# Altium schematic sheet CT.SchDoc: Conning Tower
size Tabloid; DocumentNumber: FB-001; Revision: A; SheetNumber: 2; SheetTotal: 5
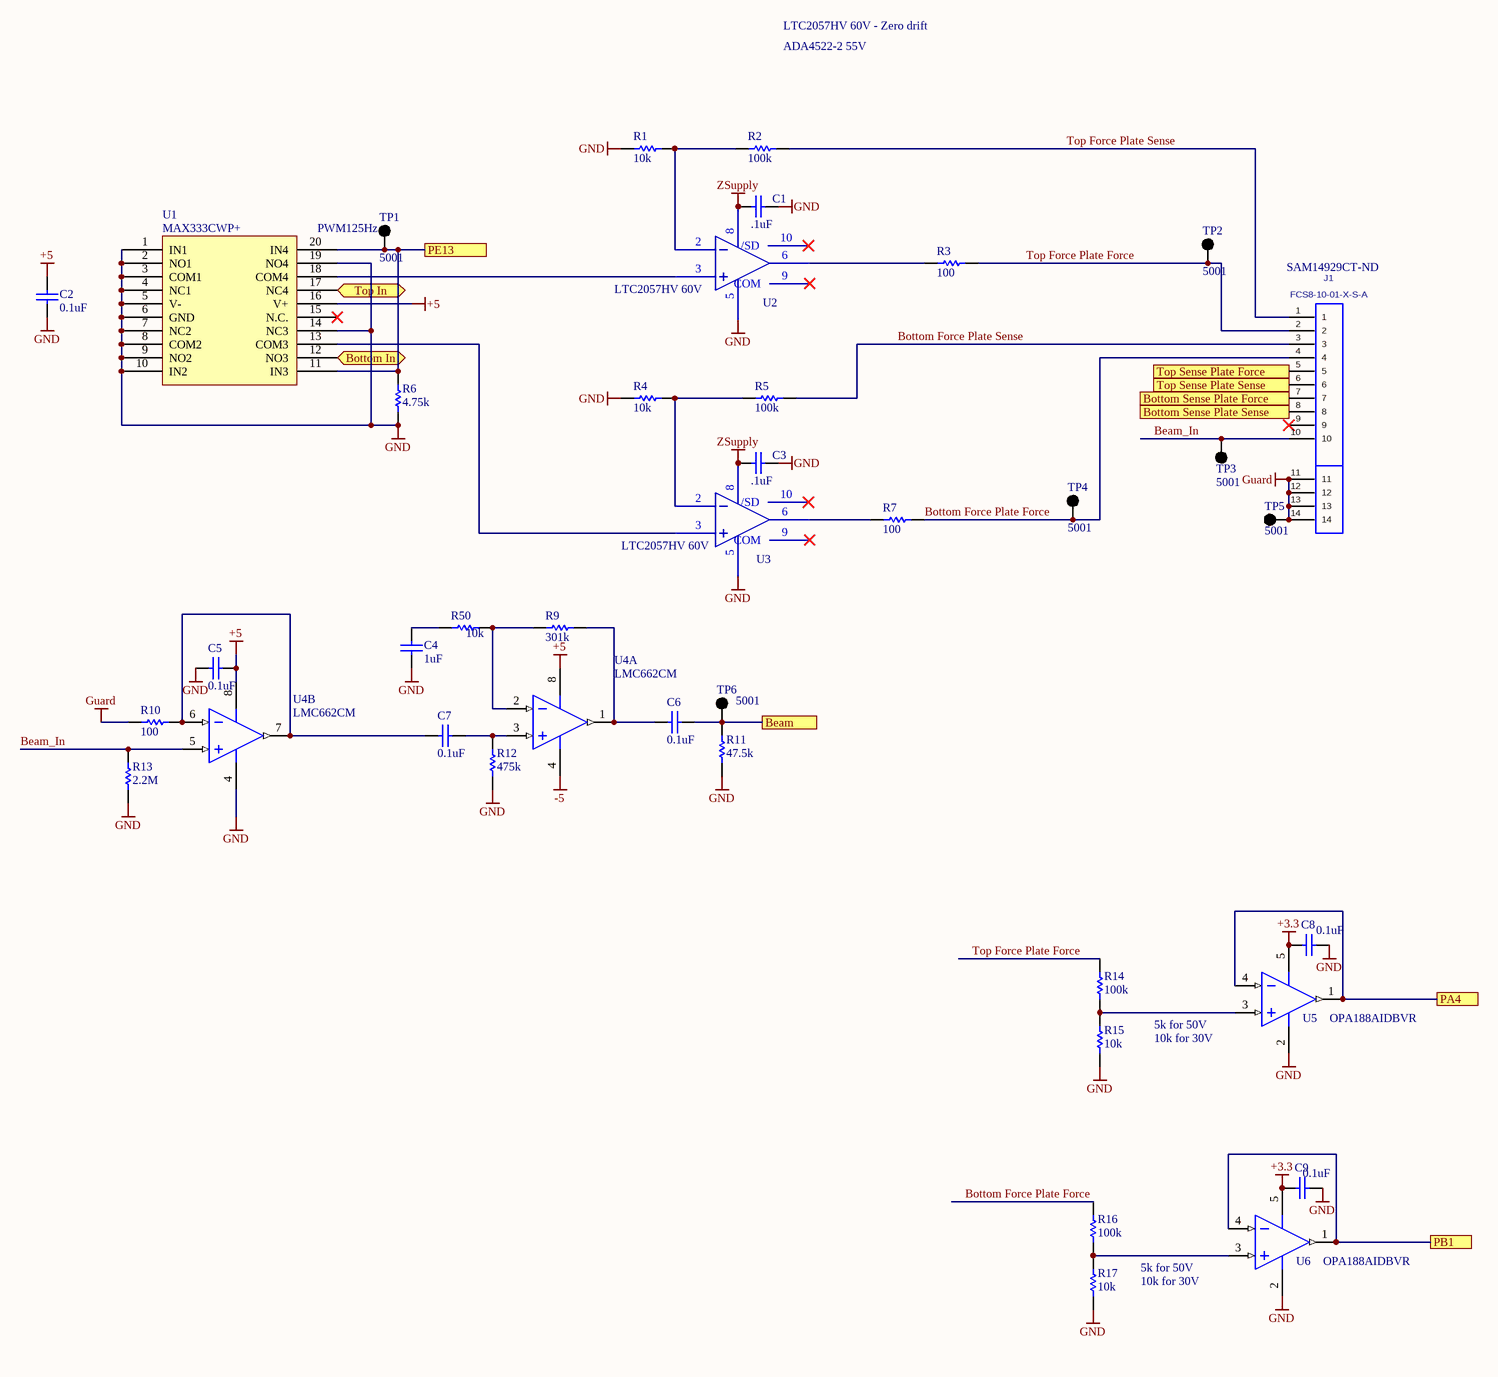
[diagram p0: CT.SchDoc]

## Parts
C1  .1uF  [CAPC0805(2012)75_M]
C2  0.1uF  [CAPC0402(1005)60_L]
C3  .1uF  [CAPC0805(2012)75_M]
C4  1uF  [CAPC0402(1005)60_L]
C5  0.1uF  [CAPC0402(1005)60_L]
C6  0.1uF  [CAPC0402(1005)60_L]
C7  0.1uF  [CAPC0402(1005)60_L]
C8  0.1uF  [CAPC0402(1005)60_L]
C9  0.1uF  [CAPC0402(1005)60_L]
J1  FCS8-10-01-X-S-A  Supplier Part Number 1: SAM14929CT-ND  [FCS8-10-01-X-S-A]
R1  10k  [RESC0402(1005)_M]
R2  100k  [RESC0402(1005)_M]
R3  100  [RESC0402(1005)_N]
R4  10k  [RESC0402(1005)_M]
R5  100k  [RESC0402(1005)_M]
R6  4.75k  [RESC1005X40X25ML05T05]
R7  100  [RESC0402(1005)_N]
R9  301k  [RESC0402(1005)_M]
R10  100  [RESC0402(1005)_M]
R11  47.5k  [RESC1005X40X25NL05T05]
R12  475k  [RESC1005X40X25LL05T05]
R13  2.2M  [RESC1005X40X25ML05T10]
R14  100k  [RESC0402(1005)_M]
R15  10k  [RESC0402(1005)_M]
R16  100k  [RESC0402(1005)_M]
R17  10k  [RESC0402(1005)_M]
R50  10k  [RESC0402(1005)_M]
TP1  5001  [KSTN-5001]
TP2  5001  [KSTN-5001]
TP3  5001  [KSTN-5001]
TP4  5001  [KSTN-5001]
TP5  5001  [KSTN-5001]
TP6  5001  [KSTN-5001]
U1  MAX333CWP+  [TSOP65P640X90-20N]
U2  LTC2057HV 60V
U3  LTC2057HV 60V
U4  LMC662CM  [D0008A_M]  (parts A,B of 2)
U5  OPA188AIDBVR  [DBV0005A_M]
U6  OPA188AIDBVR  [DBV0005A_M]

## Ports
Beam, Bottom In (bidir), Bottom Sense Plate Force, Bottom Sense Plate Sense, PA4, PB1, PE13, Top In (bidir), Top Sense Plate Force, Top Sense Plate Sense

## Nets
+3.3: C8.2 C9.2 U5.5(V+) U6.5(V+)
+5: C2.2 C5.2 U1.16(V+) U4.8(V+)
-5: U4.4(V-)
GND: C1.2 C2.1 C3.2 C4.1 C5.1 C8.1 C9.1 R1.1 R4.1 R6.1 R11.1 R12.1 R13.1 R15.1 R17.1 U1.1(IN1) U1.2(NO1) U1.3(COM1) U1.4(NC1) U1.5(V-) U1.6(GND) U1.7(NC2) U1.8(COM2) U1.9(NO2) U1.10(IN2) U1.14(NC3) U1.19(NO4) U2.5(V-) U3.5(V-) U4.4(V-) U5.2(V-) U6.2(V-)
Guard: J1.11 J1.12 J1.13 J1.14 R10.1 TP5.1
ZSupply: C1.1 C3.1 U2.8(V+) U3.8(V+)
Beam: C6.2 R11.2 TP6.1 ; port Beam
Beam_In: J1.10 R13.2 TP3.1 U4.5(INB+)
Bottom Force Plate Force: J1.4 R7.2 R16.2 TP4.1
Bottom Force Plate Sense: J1.3 R5.2
Bottom In: U1.12(NO3) ; port Bottom In
Bottom Sense Plate Force: J1.7 ; port Bottom Sense Plate Force
Bottom Sense Plate Sense: J1.8 ; port Bottom Sense Plate Sense
PA4: U5.1(OUT) U5.4(IN-) ; port PA4
PB1: U6.1(OUT) U6.4(IN-) ; port PB1
PE13: R6.2 TP1.1 U1.11(IN3) U1.20(IN4) ; port PE13
Top Force Plate Force: J1.2 R3.2 R14.2 TP2.1
Top Force Plate Sense: J1.1 R2.2
Top In: U1.17(NC4) ; port Top In
Top Sense Plate Force: J1.5 ; port Top Sense Plate Force
Top Sense Plate Sense: J1.6 ; port Top Sense Plate Sense
NetC4_2: C4.2 R50.1
NetC6_1: C6.1 R9.1 U4.1(OUTA)
NetC7_1: C7.1 R10.2 U4.6(INB-) U4.7(OUTB)
NetC7_2: C7.2 R12.2 U4.3(INA+)
NetR1_2: R1.2 R2.1 U2.2(-IN)
NetR3_1: R3.1 U2.6(OUT)
NetR4_2: R4.2 R5.1 U3.2(-IN)
NetR7_1: R7.1 U3.6(OUT)
NetR9_2: R9.2 R50.2 U4.2(INA-)
NetR14_1: R14.1 R15.2 U5.3(IN+)
NetR16_1: R16.1 R17.2 U6.3(IN+)
NetU1_13: U1.13(COM3) U3.3(+IN)
NetU1_18: U1.18(COM4) U2.3(+IN)

Not connected (* = marked no-connect by the designer): J1 9*; U1 15(N.C.)*; U2 7(N.C.) 9(COM)* 10(/SD)*; U3 7(N.C.) 9(COM)* 10(/SD)*

## Notes on the sheet
- LTC2057HV 60V - Zero drift
- ADA4522-2 55V
- PWM125Hz
- 5k for 50V
- 10k for 30V
- Title
- Size:
- Date:
- Tabloid
- Number:
- Time:
- Revision:
- Sheet
- of
- ZLS Corporation
- 7801 North Lamar Blvd.
- Suite E-184
- Austin, Texas 78752  USA
- (512) 453-0288
- File:

## Library data of the parts
C1 C3 = CMP-1036-01414-1: 0.1µF ±10% 16V Ceramic Capacitor X7R 0805 (2012 Metric); Manufacturer: Yageo; Manufacturer Part Number: CC0805KRX7R7BB104; Capacitance: 100nF; Insulation Resistance: 100GR; Supplier 1: Future Electronics; Supplier Part Number 1: CC0805KRX7R7BB104-CUTT; Stock 1: 160; Pricing 1: 1=0.0364, 100=0.0181, 250=0.0158, 500=0.0142, 1500=0.012 (USD); Mount: Surface Mount; Case/Package: 0805; Number of Pins: 2; Case Code (Metric): 2012; Case Code (Imperial): 0805; Min Operating Temperature: -55°C; Max Operating Temperature: 125°C; Tolerance: 10%; Dielectric: X7R; Voltage Rating: 16V; Voltage Rating (DC): 16V; Packaging: Tape and Reel; Package Quantity: 1; Termination: SMD/SMT; Composition: Ceramic; Voltage: 16V; Length: 2mm; Height: 0.85mm; Depth: 1.25mm; Width: 0.049inch; Thickness: 0.033inch; Radiation Hardening: No; REACH SVHC: No SVHC; Lead Free: Lead Free; Halogen Free: Halogen Free; ComponentLink1URL: http://www.farnell.com/datasheets/1784427.pdf?src-supplier=Element14; ComponentLink1Description: http://www.farnell.com/datasheets/1784427.pdf?src-supplier=Element14; ComponentLink2URL: https://www.verical.com/server-webapp/html/getDatasheet?partID=314877&src-supplier=Verical; ComponentLink2Description: https://www.verical.com/server-webapp/html/getDatasheet?partID=314877&src-supplier=Verical; ComponentLink3URL: http://www.yageo.com/documents/recent/UPY-GPHC_X7R_6.3V-to-50V_18.pdf?src-supplier=Digi-Key; ComponentLink3Description: http://www.yageo.com/documents/recent/UPY-GPHC_X7R_6.3V-to-50V_18.pdf?src-supplier=Digi-Key; ComponentLink4URL: http://www.yageo.com/documents/recent/UPY-GPHC_X7R_6.3V-to-50V_8.pdf?src-supplier=Avnet; ComponentLink4Description: http://www.yageo.com/documents/recent/UPY-GPHC_X7R_6.3V-to-50V_8.pdf?src-supplier=Avnet; ComponentLink5URL: http://www.yageo.com/documents/recent/UPY-GPHC_X7R_6.3V-to-50V_8.pdf?src-supplier=Avnet+Europe; ComponentLink5Description: http://www.yageo.com/documents/recent/UPY-GPHC_X7R_6.3V-to-50V_8.pdf?src-supplier=Avnet+Europe; ComponentLink6URL: http://www.farnell.com/datasheets/1489800.pdf?src-supplier=Element14; ComponentLink6Description: http://www.farnell.com/datasheets/1489800.pdf?src-supplier=Element14
C2 C5-C9 = CMP-1034-00252-1: CAP CER 0.1UF 10V X7R 0402; Manufacturer: Murata Electronics North America; Manufacturer Part Number: GRM155R71A104KA01D; Tolerance: ±10%; Supplier 1: Digi-Key; Supplier Part Number 1: 490-6321-1-ND; RoHS: RoHS Compliant; Category: Capacitors; Stock 1: 2920395; Pricing 1: 1=0.1, 10=0.014, 100=0.0063, 500=0.00446, 1000=0.00351, 2500=0.00319, 5000=0.00293 (USD); Packaging: Cut Tape (CT); Part Status: Active; Voltage - Rated: 10V; Temperature Coefficient: X7R; Operating Temperature: -55°C ~ 125°C; Features: -; Ratings: -; Applications: General Purpose; Mounting Type: Surface Mount, MLCC; Package / Case: 0402 (1005 Metric); Size / Dimension: 0.039" L x 0.020" W (1.00mm x 0.50mm); Height - Seated (Max): -; Thickness (Max): 0.022" (0.55mm); Lead Spacing: -; ComponentLink1URL: http://www.murata.com/~/media/webrenewal/support/library/catalog/products/capacitor/mlcc/c02e.ashx?la=en-us; ComponentLink1Description: http://www.murata.com/~/media/webrenewal/support/library/catalog/products/capacitor/mlcc/c02e.ashx?la=en-us
C4 = CMP-1034-00252-1: 1µF ±10% 16V Ceramic Capacitor X5R 0402 (1005 Metric); Manufacturer: Samsung; Manufacturer Part Number: CL05A105KO5NNNC; Supplier 1: Future Electronics; Supplier Part Number 1: CL05A105KO5NNNC-CUTT; Stock 1: 8167; Pricing 1: 1=0.0074, 500=0.0064, 1500=0.0062, 2500=0.0061, 5000=0.006 (USD); Mount: Surface Mount; Case/Package: 0402; Case Code (Metric): 1005; Case Code (Imperial): 0402; Contact Plating: Tin; Min Operating Temperature: -55°C; Max Operating Temperature: 85°C; Tolerance: 10%; Capacitance: 1uF; Dielectric: X5R; Packaging: Tape and Reel; Package Quantity: 1; Voltage Rating: 16V; Voltage: 16V; Length: 1mm; Height: 0.5mm; Width: 0.02inch; Thickness: 0.022inch; Depth: 0.5mm; Radiation Hardening: No; ComponentLink1URL: http://www1.futureelectronics.com/doc/SAMSUNG/CL05A105KO5NNNC.pdf?src-supplier=Future+Electronics; ComponentLink1Description: http://www1.futureelectronics.com/doc/SAMSUNG/CL05A105KO5NNNC.pdf?src-supplier=Future+Electronics; ComponentLink2URL: https://www.verical.com/server-webapp/html/getDatasheet?partID=355272&src-supplier=Verical; ComponentLink2Description: https://www.verical.com/server-webapp/html/getDatasheet?partID=355272&src-supplier=Verical
J1 = FCS8-10-01-X-S-A: FCS8 Socket Assembly, 20-Pins, w/ Alignment Pins; Manufacturer: Samtec; Manufacturer Part Number: FCS8-10-01-L-S-A-TR; Connector Type: Receptacle; Number of Positions: 10; CREATED: 31 NOV 2013 - WENDY XIN; Supplier 1: Digi-Key; Stock 1: 500; Pricing 1: 1=4.29000, 10=4.11800, 25=3.77520, 50=3.60360, 100=3.43200 (USD); RoHS: Yes; Mount: Surface Mount; Contact Plating: Gold; Features: Shielded; Packaging: Tape and Reel; Termination: Solder; ComponentLink1URL: http://cloud.samtec.com/catalog_english/fcs8.pdf?src-supplier=Avnet; ComponentLink1Description: http://cloud.samtec.com/catalog_english/fcs8.pdf?src-supplier=Avnet
R1 R4 R15 R17 R50 = CMP-1011-00940-1: 10k 0.063W 1% 0402 (1005 Metric)  SMD; Manufacturer: Panasonic; Manufacturer Part Number: ERJ-2RKF1002X; Resistance: 10kR; Temperature Coefficient: 100ppm/°C; Power Rating: 100mW; Voltage Rating: 50V; Supplier 1: Digi-Key; Supplier Part Number 1: P10.0KLDKR-ND; Stock 1: 12501303; Pricing 1: 1=0.10000, 10=0.04500, 100=0.01830, 1000=0.00823, 2500=0.00715, 5000=0.00590 (USD); RoHS: Yes; Mount: Surface Mount; Case/Package: 0402; Number of Pins: 2; Case Code (Metric): 1005; Case Code (Imperial): 0402; Contact Plating: Tin; Min Operating Temperature: -55°C; Max Operating Temperature: 155°C; Tolerance: 1%; Packaging: Tape and Reel; Composition: Thick Film; Termination: SMD/SMT; Voltage Rating (DC): 50V; Package Quantity: 1; Number of Terminations: 2; Max Power Dissipation: 100mW; Military Standard: Not; Features: Automotive AEC-Q200; Length: 1mm; Height: 0.35mm; Width: 0.02inch; Depth: 0.5mm; Radiation Hardening: No; Lead Free: Lead Free; REACH SVHC: No SVHC; ComponentLink1URL: https://datasheet.ciiva.com/11821/0900766b80f80784-11821171.pdf?src-supplier=RSComponents; ComponentLink1Description: https://datasheet.ciiva.com/11821/0900766b80f80784-11821171.pdf?src-supplier=RSComponents; ComponentLink2URL: https://datasheet.ciiva.com/16199/aoa0000ce2-16199478.pdf?src-supplier=Future+Electronics; ComponentLink2Description: https://datasheet.ciiva.com/16199/aoa0000ce2-16199478.pdf?src-supplier=Future+Electronics; ComponentLink3URL: https://datasheet.ciiva.com/17212/aoa0000ce2-17212102.pdf?src-supplier=Avnet+Europe; ComponentLink3Description: https://datasheet.ciiva.com/17212/aoa0000ce2-17212102.pdf?src-supplier=Avnet+Europe; ComponentLink4URL: https://datasheet.ciiva.com/24023/aoa0000ce2-24023017.pdf?src-supplier=Mouser; ComponentLink4Description: https://datasheet.ciiva.com/24023/aoa0000ce2-24023017.pdf?src-supplier=Mouser; ComponentLink5URL: https://datasheet.ciiva.com/28514/1678782-28514185.pdf?src-supplier=Element14; ComponentLink5Description: https://datasheet.ciiva.com/28514/1678782-28514185.pdf?src-supplier=Element14; ComponentLink6URL: https://datasheet.ciiva.com/43467/1678782-43467402.pdf?src-supplier=Farnell; ComponentLink6Description: https://datasheet.ciiva.com/43467/1678782-43467402.pdf?src-supplier=Farnell; ComponentLink7URL: https://datasheet.ciiva.com/27055/1987020-27055643.pdf?src-supplier=Jameco; ComponentLink7Description: https://datasheet.ciiva.com/27055/1987020-27055643.pdf?src-supplier=Jameco; ComponentLink8URL: https://datasheet.ciiva.com/48531/aoa0000ce2-48531069.pdf?src-supplier=Avnet; ComponentLink8Description: https://datasheet.ciiva.com/48531/aoa0000ce2-48531069.pdf?src-supplier=Avnet; ComponentLink9URL: https://datasheet.ciiva.com/9194/aoa0000ce2-9194142.pdf?src-supplier=Avnet; ComponentLink9Description: https://datasheet.ciiva.com/9194/aoa0000ce2-9194142.pdf?src-supplier=Avnet; ComponentLink10URL: https://datasheet.ciiva.com/16782/70260748-16782590.pdf?src-supplier=Allied+Electronics; ComponentLink10Description: https://datasheet.ciiva.com/16782/70260748-16782590.pdf?src-supplier=Allied+Electronics; ComponentLink11URL: https://datasheet.ciiva.com/16786/70260748-16786734.pdf?src-supplier=Allied+Electronics; ComponentLink11Description: https://datasheet.ciiva.com/16786/70260748-16786734.pdf?src-supplier=Allied+Electronics; ComponentLink12URL: https://datasheet.ciiva.com/30201/aoa0000ce2-30201022.pdf?src-supplier=Onlinecomponents.com; ComponentLink12Description: https://datasheet.ciiva.com/30201/aoa0000ce2-30201022.pdf?src-supplier=Onlinecomponents.com
R2 R5 R14 R16 = CMP-1011-00940-1: 100k 0.063W 1% 0402 (1005 Metric)  SMD; Manufacturer: Panasonic; Manufacturer Part Number: ERJ-2RKF1003X; Resistance: 100kR; Power Rating: 100mW; Temperature Coefficient: 100ppm/°C; Voltage Rating: 50V; Supplier 1: Digi-Key; Supplier Part Number 1: P100KLCT-ND; Stock 1: 9533476; Pricing 1: 1=0.10000, 10=0.04500, 100=0.01830, 1000=0.00823, 2500=0.00715, 5000=0.00590 (USD); RoHS: Yes; Mount: Surface Mount; Case/Package: 0402; Number of Pins: 2; Case Code (Imperial): 0402; Case Code (Metric): 1005; Contact Plating: Tin; Min Operating Temperature: -55°C; Max Operating Temperature: 155°C; Tolerance: 1%; Packaging: Tape and Reel; Composition: Thick Film; Voltage Rating (DC): 50V; Termination: SMD/SMT; Military Standard: Not; Package Quantity: 1; Number of Terminations: 2; Max Power Dissipation: 100mW; Features: Automotive AEC-Q200; Length: 1mm; Height: 0.35mm; Width: 0.5mm; Depth: 0.5mm; Radiation Hardening: No; Lead Free: Lead Free; REACH SVHC: No SVHC; ComponentLink1URL: https://datasheet.ciiva.com/11821/0900766b80f80784-11821175.pdf?src-supplier=RSComponents; ComponentLink1Description: https://datasheet.ciiva.com/11821/0900766b80f80784-11821175.pdf?src-supplier=RSComponents; ComponentLink2URL: https://datasheet.ciiva.com/34303/1987038-34303550.pdf?src-supplier=Jameco; ComponentLink2Description: https://datasheet.ciiva.com/34303/1987038-34303550.pdf?src-supplier=Jameco; ComponentLink3URL: https://datasheet.ciiva.com/7830/aoa0000ce2-7830725.pdf?src-supplier=Element14; ComponentLink3Description: https://datasheet.ciiva.com/7830/aoa0000ce2-7830725.pdf?src-supplier=Element14; ComponentLink4URL: https://datasheet.ciiva.com/16522/aoa0000ce2-16522647.pdf?src-supplier=Avnet+Asia; ComponentLink4Description: https://datasheet.ciiva.com/16522/aoa0000ce2-16522647.pdf?src-supplier=Avnet+Asia; ComponentLink5URL: https://datasheet.ciiva.com/16778/70260748-16778055.pdf?src-supplier=Allied+Electronics; ComponentLink5Description: https://datasheet.ciiva.com/16778/70260748-16778055.pdf?src-supplier=Allied+Electronics; ComponentLink6URL: https://datasheet.ciiva.com/43467/1678782-43467480.pdf?src-supplier=Farnell; ComponentLink6Description: https://datasheet.ciiva.com/43467/1678782-43467480.pdf?src-supplier=Farnell; ComponentLink7URL: https://datasheet.ciiva.com/16440/aoa0000ce2-16440217.pdf?src-supplier=Future+Electronics; ComponentLink7Description: https://datasheet.ciiva.com/16440/aoa0000ce2-16440217.pdf?src-supplier=Future+Electronics; ComponentLink8URL: https://datasheet.ciiva.com/30245/aoa0000ce2-30245691.pdf?src-supplier=Onlinecomponents.com; ComponentLink8Description: https://datasheet.ciiva.com/30245/aoa0000ce2-30245691.pdf?src-supplier=Onlinecomponents.com; ComponentLink9URL: https://datasheet.ciiva.com/7830/426256-7830974.pdf?src-supplier=Element14; ComponentLink9Description: https://datasheet.ciiva.com/7830/426256-7830974.pdf?src-supplier=Element14; ComponentLink10URL: https://datasheet.ciiva.com/16784/70260748-16784190.pdf?src-supplier=Allied+Electronics; ComponentLink10Description: https://datasheet.ciiva.com/16784/70260748-16784190.pdf?src-supplier=Allied+Electronics; ComponentLink11URL: https://datasheet.ciiva.com/22723/426256-22723902.pdf?src-supplier=Element14; ComponentLink11Description: https://datasheet.ciiva.com/22723/426256-22723902.pdf?src-supplier=Element14; ComponentLink12URL: https://datasheet.ciiva.com/48531/aoa0000ce2-48531070.pdf?src-supplier=Avnet; ComponentLink12Description: https://datasheet.ciiva.com/48531/aoa0000ce2-48531070.pdf?src-supplier=Avnet; ComponentLink13URL: https://datasheet.ciiva.com/9186/aoa0000ce2-9186687.pdf?src-supplier=Avnet; ComponentLink13Description: https://datasheet.ciiva.com/9186/aoa0000ce2-9186687.pdf?src-supplier=Avnet
R3 R7 = CMP-1011-00397-1: RES SMD 100 OHM 1% 1/16W 0402; Manufacturer: Vishay Dale; Manufacturer Part Number: CRCW0402100RFKED; Case-EIA: 0402; Power: 0.063 W; Case-Metric: 1005; Value: 100.00 Ohm; Resistance: 100R; Temperature Coefficient: 100ppm/°C; Power Rating: 63mW; Voltage Rating: 50V; Technology: SMT; Tolerance: 1 %; Supplier 1: Digi-Key; Supplier Part Number 1: 541-100LCT-ND; Stock 1: 503914; Pricing 1: 1=0.10000, 10=0.03800, 100=0.01540, 1000=0.00690, 2500=0.00599, 5000=0.00495 (USD); RoHS: Yes; Mount: Surface Mount; Case/Package: 0402; Weight: 2.3E-05oz; Case Code (Imperial): 0402; Case Code (Metric): 1005; Contact Plating: Tin; Min Operating Temperature: -55°C; Max Operating Temperature: 155°C; Packaging: Tape and Reel; Composition: Thick Film; Voltage Rating (DC): 50V; Number of Terminations: 2; Max Power Dissipation: 63mW; Military Standard: Not; Termination: SMD/SMT; Features: Automotive AEC-Q200; Package Quantity: 10; Working Voltage: 50V; Length: 1mm; Height: 0.35mm; Width: 0.02inch; Depth: 0.5mm; Radiation Hardening: No; REACH SVHC: Unknown; Lead Free: Lead Free; ComponentLink1URL: https://datasheet.ciiva.com/11809/0900766b80d98824-11809081.pdf?src-supplier=RSComponents; ComponentLink1Description: https://datasheet.ciiva.com/11809/0900766b80d98824-11809081.pdf?src-supplier=RSComponents; ComponentLink2URL: https://datasheet.ciiva.com/2463/dcrcwe3-2463094.pdf?src-supplier=Digi-Key; ComponentLink2Description: https://datasheet.ciiva.com/2463/dcrcwe3-2463094.pdf?src-supplier=Digi-Key; ComponentLink3URL: https://datasheet.ciiva.com/16199/dcrcwe3-16199158.pdf?src-supplier=Future+Electronics; ComponentLink3Description: https://datasheet.ciiva.com/16199/dcrcwe3-16199158.pdf?src-supplier=Future+Electronics; ComponentLink4URL: https://datasheet.ciiva.com/2463/dcrcwe3-2463095.pdf?src-supplier=Digi-Key; ComponentLink4Description: https://datasheet.ciiva.com/2463/dcrcwe3-2463095.pdf?src-supplier=Digi-Key; ComponentLink5URL: https://datasheet.ciiva.com/2463/dcrcwe3-2463096.pdf?src-supplier=Digi-Key; ComponentLink5Description: https://datasheet.ciiva.com/2463/dcrcwe3-2463096.pdf?src-supplier=Digi-Key; ComponentLink6URL: https://datasheet.ciiva.com/5552/dcrcwe3-109170-5552168.pdf?src-supplier=Mouser; ComponentLink6Description: https://datasheet.ciiva.com/5552/dcrcwe3-109170-5552168.pdf?src-supplier=Mouser; ComponentLink7URL: https://datasheet.ciiva.com/8083/dcrcwe3-8083977.pdf?src-supplier=Avnet; ComponentLink7Description: https://datasheet.ciiva.com/8083/dcrcwe3-8083977.pdf?src-supplier=Avnet; ComponentLink8URL: https://datasheet.ciiva.com/16722/70201119-16722524.pdf?src-supplier=Allied+Electronics; ComponentLink8Description: https://datasheet.ciiva.com/16722/70201119-16722524.pdf?src-supplier=Allied+Electronics; ComponentLink9URL: https://datasheet.ciiva.com/22673/1697337-22673117.pdf?src-supplier=Element14; ComponentLink9Description: https://datasheet.ciiva.com/22673/1697337-22673117.pdf?src-supplier=Element14; ComponentLink10URL: https://datasheet.ciiva.com/22673/1697337-22673118.pdf?src-supplier=Element14; ComponentLink10Description: https://datasheet.ciiva.com/22673/1697337-22673118.pdf?src-supplier=Element14; ComponentLink11URL: https://datasheet.ciiva.com/3255/dcrcwe3-3255951.pdf?src-supplier=Avnet; ComponentLink11Description: https://datasheet.ciiva.com/3255/dcrcwe3-3255951.pdf?src-supplier=Avnet
R6 = CMP-2002-00956-3: Chip Resistor, 4.75 KOhm, +/- 1%, 100 mW, -55 to 155 degC, 0402 (1005 Metric), RoHS, Tape and Reel; PartNumber: ERJ-2RKF4751X; Manufacturer: Basic Passives; Case\/Package: 0402; Voltage Rating: 50 V; Power Rating: 100 mW; Description: Panasonic Surface Mount Fixed Resistor 4.75k 0.1W 100 ppm/C; Temperature Coefficient: 100ppm/°C; Max Power Dissipation: 100mW; Voltage Rating (DC): 50V; ComponentLink1Description: Manufacturer URL; RoHSCompliant: true; PackageReference: 0402; Mounting Technology: Surface Mount; Package Quantity: 10000; Length: 1 mm; PackageDescription: 2-Pin Surface Mount Device, Body 1 x 0.5 mm; Packaging: Tape and Reel; Pins: 2; ComponentLink2Description: Datasheet; Max Operating Temperature: 155 degC; Min Operating Temperature: -55 degC; DatasheetVersion: 04/2015; Resistance: 4.75 KOhm; Width: 0.5 mm; REACH SVHC: Yes; ComponentLink2URL: http://industrial.panasonic.com/cdbs/www-data/pdf/RDA0000/AOA0000C86.pdf; ComponentLink1URL: http://www.panasonic.com/; Mount: Surface Mount; Case Code (Metric): 1005; Tolerance: 1%; Radiation Hardening: No; Height: 0.35 mm; Case Code (Imperial): 0402; Supplier 1: Digi-Key; Supplier Part Number 1: P4.75KLCT-ND; Manufacturer Part Number: ERJ-2RKF4751X; Stock 1: 4813613; Pricing 1: 1=0.10000, 10=0.04500, 100=0.01830, 1000=0.00823, 2500=0.00715, 5000=0.00590 (USD); RoHS: Yes; Case/Package: 0402; Contact Plating: Tin; Composition: Thick Film; Number of Terminations: 2; Termination: SMD/SMT; Military Standard: Not; Features: Automotive AEC-Q200; Depth: 0.5mm; Lead Free: Lead Free; ComponentLink3URL: https://datasheet.ciiva.com/34303/1987302-34303560.pdf?src-supplier=Jameco; ComponentLink3Description: https://datasheet.ciiva.com/34303/1987302-34303560.pdf?src-supplier=Jameco; ComponentLink4URL: https://datasheet.ciiva.com/9195/aoa0000ce2-9195605.pdf?src-supplier=Avnet; ComponentLink4Description: https://datasheet.ciiva.com/9195/aoa0000ce2-9195605.pdf?src-supplier=Avnet; ComponentLink5URL: https://datasheet.ciiva.com/28672/1678782-28672344.pdf?src-supplier=Element14; ComponentLink5Description: https://datasheet.ciiva.com/28672/1678782-28672344.pdf?src-supplier=Element14; ComponentLink6URL: https://datasheet.ciiva.com/22775/426256-22775449.pdf?src-supplier=Farnell; ComponentLink6Description: https://datasheet.ciiva.com/22775/426256-22775449.pdf?src-supplier=Farnell; ComponentLink7URL: https://datasheet.ciiva.com/30083/aoa0000ce2-30083610.pdf?src-supplier=Onlinecomponents.com; ComponentLink7Description: https://datasheet.ciiva.com/30083/aoa0000ce2-30083610.pdf?src-supplier=Onlinecomponents.com; ComponentLink8URL: https://datasheet.ciiva.com/16789/70260748-16789147.pdf?src-supplier=Allied+Electronics; ComponentLink8Description: https://datasheet.ciiva.com/16789/70260748-16789147.pdf?src-supplier=Allied+Electronics; ComponentLink9URL: https://datasheet.ciiva.com/16508/aoa0000ce2-16508525.pdf?src-supplier=Future+Electronics; ComponentLink9Description: https://datasheet.ciiva.com/16508/aoa0000ce2-16508525.pdf?src-supplier=Future+Electronics; ComponentLink10URL: https://datasheet.ciiva.com/24071/aoa0000ce2-24071309.pdf?src-supplier=Mouser; ComponentLink10Description: https://datasheet.ciiva.com/24071/aoa0000ce2-24071309.pdf?src-supplier=Mouser; ComponentLink11URL: https://datasheet.ciiva.com/46377/426256-46377917.pdf?src-supplier=Element14; ComponentLink11Description: https://datasheet.ciiva.com/46377/426256-46377917.pdf?src-supplier=Element14; ComponentLink12URL: https://datasheet.ciiva.com/46389/426256-46389677.pdf?src-supplier=Element14; ComponentLink12Description: https://datasheet.ciiva.com/46389/426256-46389677.pdf?src-supplier=Element14
R9 = CMP-1011-00463-1: RES SMD 301K OHM 1% 1/10W 0402; Manufacturer: Panasonic; Manufacturer Part Number: ERJ-2RKF3013X; Resistance: 301kR; Temperature Coefficient: 100ppm/°C; Power Rating: 100mW; Voltage Rating: 50V; Supplier 1: Digi-Key; Supplier Part Number 1: P301KLCT-ND; Stock 1: 413342; Pricing 1: 1=0.10000, 10=0.04500, 100=0.01830, 1000=0.00823, 2500=0.00715, 5000=0.00590 (USD); RoHS: Yes; Mount: Surface Mount; Case/Package: 0402; Weight: 2.8E-05oz; Case Code (Metric): 1005; Case Code (Imperial): 0402; Contact Plating: Tin; Min Operating Temperature: -55°C; Max Operating Temperature: 155°C; Packaging: Tape and Reel; Tolerance: 1%; Composition: Thick Film; Package Quantity: 1; Number of Terminations: 2; Max Power Dissipation: 100mW; Termination: SMD/SMT; Voltage Rating (DC): 50V; Features: Automotive AEC-Q200; Military Standard: Not; Length: 1mm; Height: 0.016inch; Width: 0.02inch; Depth: 0.5mm; Lead Free: Lead Free; REACH SVHC: Unknown; ComponentLink1URL: https://datasheet.ciiva.com/28531/1678782-28531429.pdf?src-supplier=Element14; ComponentLink1Description: https://datasheet.ciiva.com/28531/1678782-28531429.pdf?src-supplier=Element14; ComponentLink2URL: https://datasheet.ciiva.com/16780/70260748-16780326.pdf?src-supplier=Allied+Electronics; ComponentLink2Description: https://datasheet.ciiva.com/16780/70260748-16780326.pdf?src-supplier=Allied+Electronics; ComponentLink3URL: https://datasheet.ciiva.com/30260/aoa0000ce2-30260647.pdf?src-supplier=Onlinecomponents.com; ComponentLink3Description: https://datasheet.ciiva.com/30260/aoa0000ce2-30260647.pdf?src-supplier=Onlinecomponents.com; ComponentLink4URL: https://datasheet.ciiva.com/28683/1678782-28683161.pdf?src-supplier=Element14; ComponentLink4Description: https://datasheet.ciiva.com/28683/1678782-28683161.pdf?src-supplier=Element14; ComponentLink5URL: https://datasheet.ciiva.com/16771/70260748-16771500.pdf?src-supplier=Allied+Electronics; ComponentLink5Description: https://datasheet.ciiva.com/16771/70260748-16771500.pdf?src-supplier=Allied+Electronics; ComponentLink6URL: https://datasheet.ciiva.com/24161/aoa0000ce2-24161740.pdf?src-supplier=Mouser; ComponentLink6Description: https://datasheet.ciiva.com/24161/aoa0000ce2-24161740.pdf?src-supplier=Mouser; ComponentLink7URL: https://datasheet.ciiva.com/46388/426256-46388702.pdf?src-supplier=Element14; ComponentLink7Description: https://datasheet.ciiva.com/46388/426256-46388702.pdf?src-supplier=Element14; ComponentLink8URL: https://datasheet.ciiva.com/9183/aoa0000ce2-9183247.pdf?src-supplier=Avnet; ComponentLink8Description: https://datasheet.ciiva.com/9183/aoa0000ce2-9183247.pdf?src-supplier=Avnet
R10 = CMP-1011-00940-1: 6M34 0.063W 1% 0402 (1005 Metric)  SMD; Manufacturer: Panasonic; Manufacturer Part Number: ERJ-2RKF1000X; Resistance: 100R; Power Rating: 100mW; Voltage Rating: 50V; Temperature Coefficient: 100ppm/°C; Supplier 1: Digi-Key; Supplier Part Number 1: P100LCT-ND; Stock 1: 6071624; Pricing 1: 1=0.10000, 10=0.04500, 100=0.01830, 1000=0.00823, 2500=0.00715, 5000=0.00590 (USD); RoHS: Yes; Mount: Surface Mount; Case/Package: 0402; Number of Pins: 2; Case Code (Imperial): 0402; Case Code (Metric): 1005; Contact Plating: Tin; Min Operating Temperature: -55°C; Max Operating Temperature: 155°C; Packaging: Tape and Reel; Tolerance: 1%; Package Quantity: 1; Termination: SMD/SMT; Composition: Thick Film; Number of Terminations: 2; Military Standard: Not; Max Power Dissipation: 100mW; Voltage Rating (DC): 50V; Features: Automotive AEC-Q200; Length: 1mm; Height: 0.35mm; Width: 0.5mm; Depth: 0.5mm; Radiation Hardening: No; REACH SVHC: No SVHC; Lead Free: Lead Free
R11 = CMP-2002-00957-1: RESISTOR, 0402, 47K5 1%, 0.1W; Part Number: ERJ-2RKF4752X; Manufacturer: Panasonic; Resistance: 47.5kR; Power Rating: 100mW; Voltage Rating: 50V; Temperature Coefficient: 100ppm/°C; Supplier 1: Digi-Key; Supplier Part Number 1: P47.5KLCT-ND; Manufacturer Part Number: ERJ-2RKF4752X; Stock 1: 773638; Pricing 1: 1=0.10000, 10=0.04500, 100=0.01830, 1000=0.00823, 2500=0.00715, 5000=0.00590 (USD); RoHS: Yes; Mount: Surface Mount; Case/Package: 0402; Case Code (Metric): 1005; Case Code (Imperial): 0402; Contact Plating: Tin; Min Operating Temperature: -55°C; Max Operating Temperature: 155°C; Tolerance: 1%; Packaging: Tape and Reel; Package Quantity: 1; Composition: Thick Film; Number of Terminations: 2; Termination: SMD/SMT; Military Standard: Not; Max Power Dissipation: 100mW; Voltage Rating (DC): 50V; Features: Automotive AEC-Q200; Length: 1mm; Height: 0.35mm; Width: 0.02inch; Depth: 0.5mm; REACH SVHC: No SVHC; Lead Free: Lead Free; ComponentLink1URL: https://datasheet.ciiva.com/16786/70260748-16786261.pdf?src-supplier=Allied+Electronics; ComponentLink1Description: https://datasheet.ciiva.com/16786/70260748-16786261.pdf?src-supplier=Allied+Electronics; ComponentLink2URL: https://datasheet.ciiva.com/5969/426256-5969222.pdf?src-supplier=Farnell; ComponentLink2Description: https://datasheet.ciiva.com/5969/426256-5969222.pdf?src-supplier=Farnell; ComponentLink3URL: https://datasheet.ciiva.com/16759/70260748-16759480.pdf?src-supplier=Allied+Electronics; ComponentLink3Description: https://datasheet.ciiva.com/16759/70260748-16759480.pdf?src-supplier=Allied+Electronics; ComponentLink4URL: https://datasheet.ciiva.com/43460/426256-43460330.pdf?src-supplier=Farnell; ComponentLink4Description: https://datasheet.ciiva.com/43460/426256-43460330.pdf?src-supplier=Farnell; ComponentLink5URL: https://datasheet.ciiva.com/30225/aoa0000ce2-30225053.pdf?src-supplier=Onlinecomponents.com; ComponentLink5Description: https://datasheet.ciiva.com/30225/aoa0000ce2-30225053.pdf?src-supplier=Onlinecomponents.com; ComponentLink6URL: https://datasheet.ciiva.com/46377/426256-46377551.pdf?src-supplier=Element14; ComponentLink6Description: https://datasheet.ciiva.com/46377/426256-46377551.pdf?src-supplier=Element14
R12 = CMP-2002-00958-1: Resistor 0402 Case 475k 1% 0.1W 100ppm/C; Part Number: ERJ-2RKF4753X; Manufacturer: Panasonic; Description: Panasonic ERJ2RK Series Precision Thick Film Surface Mount Resistor 0402 Case 475k 1% 0.1W 100ppm/C; Resistance: 475kR; Power Rating: 100mW; Voltage Rating: 50V; Temperature Coefficient: 100ppm/°C; Supplier 1: Digi-Key; Supplier Part Number 1: P475KLCT-ND; Manufacturer Part Number: ERJ-2RKF4753X; Stock 1: 105093; Pricing 1: 1=0.10000, 10=0.04500, 100=0.01830, 1000=0.00823, 2500=0.00715, 5000=0.00590 (USD); RoHS: Yes; Mount: Surface Mount; Case/Package: 0402; Case Code (Metric): 1005; Case Code (Imperial): 0402; Contact Plating: Tin; Min Operating Temperature: -55°C; Max Operating Temperature: 155°C; Tolerance: 1%; Packaging: Tape and Reel; Package Quantity: 10000; Composition: Thick Film; Number of Terminations: 2; Termination: SMD/SMT; Military Standard: Not; Max Power Dissipation: 100mW; Voltage Rating (DC): 50V; Length: 1mm; Height: 0.35mm; Width: 0.02inch; Depth: 0.5mm; REACH SVHC: Yes; Lead Free: Lead Free; ComponentLink1URL: https://datasheet.ciiva.com/7942/aoa0000ce2-7942357.pdf?src-supplier=Element14; ComponentLink1Description: https://datasheet.ciiva.com/7942/aoa0000ce2-7942357.pdf?src-supplier=Element14; ComponentLink2URL: https://datasheet.ciiva.com/46373/1678782-46373126.pdf?src-supplier=Element14; ComponentLink2Description: https://datasheet.ciiva.com/46373/1678782-46373126.pdf?src-supplier=Element14; ComponentLink3URL: https://datasheet.ciiva.com/9181/aoa0000ce2-9181671.pdf?src-supplier=Avnet; ComponentLink3Description: https://datasheet.ciiva.com/9181/aoa0000ce2-9181671.pdf?src-supplier=Avnet; ComponentLink4URL: https://datasheet.ciiva.com/22721/1678782-22721543.pdf?src-supplier=Farnell; ComponentLink4Description: https://datasheet.ciiva.com/22721/1678782-22721543.pdf?src-supplier=Farnell; ComponentLink5URL: https://datasheet.ciiva.com/46373/1678782-46373127.pdf?src-supplier=Element14; ComponentLink5Description: https://datasheet.ciiva.com/46373/1678782-46373127.pdf?src-supplier=Element14; ComponentLink6URL: https://datasheet.ciiva.com/43467/1678782-43467546.pdf?src-supplier=Farnell; ComponentLink6Description: https://datasheet.ciiva.com/43467/1678782-43467546.pdf?src-supplier=Farnell; ComponentLink7URL: https://datasheet.ciiva.com/16759/70260748-16759533.pdf?src-supplier=Allied+Electronics; ComponentLink7Description: https://datasheet.ciiva.com/16759/70260748-16759533.pdf?src-supplier=Allied+Electronics
R13 = CMP-2002-07061-1: Part Number: RC0402FR-072M2L; Manufacturer: Yageo / Phycomp; Description: RESISTOR, 0402 2M2 1%, REEL 10000; Resistance: 2.2MR; Power Rating: 63mW; Tolerance: 1%; Voltage Rating: 50V; Temperature Coefficient: 100ppm/°C; Supplier 1: Future Electronics; Supplier Part Number 1: RC0402FR-072M2L-REEL; Manufacturer Part Number: RC0402FR-072M2L; Stock 1: 180000; Pricing 1: 10000=0.00100, 50000=0.00080, 200000=0.00080, 400000=0.00080, 1000000=0.00070 (USD); RoHS: Yes; Case/Package: 0402; Number of Pins: 2; Case Code (Imperial): 0402; Case Code (Metric): 1005; Min Operating Temperature: -55°C; Max Operating Temperature: 155°C; Voltage Rating (DC): 50V; Packaging: Tape and Reel; Composition: Thick Film; Termination: SMD/SMT; Number of Terminations: 2; Military Standard: Not; Max Power Dissipation: 63mW; Features: Moisture Resistant; Length: 1mm; Height: 0.016inch; Width: 0.5mm; Depth: 0.5mm; REACH SVHC: Unknown; Lead Free: Lead Free; ComponentLink1URL: https://datasheet.ciiva.com/6168/1686128-6168958.pdf?src-supplier=Farnell; ComponentLink1Description: https://datasheet.ciiva.com/6168/1686128-6168958.pdf?src-supplier=Farnell
TP1-TP6 = CMP-2000-05181-1: Test Point, Black, 1-Pin THD, RoHS, Bulk; Manufacturer: Keystone; Other Names: 5001K; Catalog Drawings: 5000Series; Alternate Color: 5004K-ND / -TESTPOINTPCMINI.040"DYELLOW / 5003K-ND / -TESTPOINTPCMINI.040"DORANGE / 5002K-ND / -TESTPOINTPCMINI.040"DWHITE / 5000K-ND / -TESTPOINTPCMINI.040"DRED; Kits: DKTGRS232C-KIT-ND / -TTLCONVERTER; Online Catalog: ColorCodedTestPoints; Datasheet URL: https://ciiva.com/datasheet-click-2917627?src=ciiva&sig=bd195616; Mounting Type: 0.040"(1.02mm)HoleDiameter; Family: TestPoints; RoHS Information: RoHSComplianceStatement; Datasheet Version: Rev. G, 12/2008; Color: Black; Category: TestandMeasurement; Standard Package: 100; Manufacturer URL: http://www.keyelco.com/; Material: Base,Nylon46,UL94V-0; Type: PCTestPoint,Miniature; Terminal: 0.010"x0.020"(0.25mmx0.51mm)PhosphorBronzeWire,SilverPlated; Series: THM; Packaging: Bulk
U1 = MAX333CWP+: IC SWITCH QUAD SPDT 20TSSOP; Manufacturer: Maxim; Manufacturer Part Number: MAX333AEUP+; Max Supply Voltage: 30V; Min Supply Voltage: 10V; Min Dual Supply Voltage: 4.5V; Max Dual Supply Voltage: 20V; On-State Resistance: 35R; Operating Supply Current: 1uA; Supply Type: Single,Dual; Max Power Dissipation: 559mW; Turn-On Delay Time: 175ns; Turn-Off Delay Time: 145ns; Max Supply Current: 250uA; Number of Bits: 4; Dual Supply Voltage: 15V; Supplier 1: Mouser; Supplier Part Number 1: 700-MAX333AEUP; Stock 1: 664; Pricing 1: 1=6.77, 10=6.43, 50=5.8, 100=5.8, 1000=5.62, 10000=5.62 (USD); Case/Package: TSSOP; Number of Pins: 20; Weight: 0.006737oz; Min Operating Temperature: -40°C; Max Operating Temperature: 85°C; Packaging: Rail/Tube; Package Quantity: 74; Throw Configuration: SPDT; Number of Channels: 4; Length: 6.6mm; Height: 0.95mm; Width: 4.5mm; Radiation Hardening: No; Lead Free: Lead Free; REACH SVHC: Unknown; ComponentLink1URL: https://datasheet.ciiva.com/2978/max333a-2978850.pdf; ComponentLink1Description: https://datasheet.ciiva.com/2978/max333a-2978850.pdf; ComponentLink2URL: https://datasheet.ciiva.com/30478/0900766b81253c85-30478260.pdf; ComponentLink2Description: https://datasheet.ciiva.com/30478/0900766b81253c85-30478260.pdf; ComponentLink3URL: https://datasheet.ciiva.com/1674/max333a-1674617.pdf; ComponentLink3Description: https://datasheet.ciiva.com/1674/max333a-1674617.pdf; ComponentLink4URL: https://datasheet.ciiva.com/26825/max333aeup-26825546.pdf; ComponentLink4Description: https://datasheet.ciiva.com/26825/max333aeup-26825546.pdf
U2 U3 = LTC2057HV 60V: IC OPAMP ZRO-DRFT 1.5MHZ 10MSOP; Manufacturer: Analog Devices / Linear Technology; Manufacturer Part Number: LTC2057HVHMS#PBF; Slew Rate: 0.45V/µs; Number of Circuits: 1; Input Bias Current: 30pA; Input Offset Voltage (Vos): 0.5uV; Operating Supply Current: 900uA; Output Current per Channel: 30mA; Common Mode Rejection Ratio: 128dB; Min Supply Voltage: 4.75V; Voltage Gain: 150dB; Supplier 1: Digi-Key; Supplier Part Number 1: LTC2057HVHMS#PBF-ND; Stock 1: 30; Pricing 1: 1=6.53000, 25=4.33440, 100=3.58400, 250=3.40480, 500=3.32800 (USD); RoHS: Yes; Mount: Surface Mount; Case/Package: MSOP; Number of Pins: 10; Min Operating Temperature: -40°C; Max Operating Temperature: 125°C; Bandwidth: 1.5MHz; Package Quantity: 50; Packaging: Rail/Tube; Gain Bandwidth Product: 1.5MHz; Number of Amplifiers: 1; Number of Channels: 1; Unity Gain Bandwidth Product: 1.5MHz; Max Supply Voltage: 60V; Number of Elements: 1; REACH SVHC: No SVHC; ComponentLink1URL: https://datasheet.ciiva.com/22733/1761439-22733472.pdf?src-supplier=Element14; ComponentLink1Description: https://datasheet.ciiva.com/22733/1761439-22733472.pdf?src-supplier=Element14; ComponentLink2URL: https://datasheet.ciiva.com/25651/1761439-25651624.pdf?src-supplier=Farnell; ComponentLink2Description: https://datasheet.ciiva.com/25651/1761439-25651624.pdf?src-supplier=Farnell
U4 = CMP-0055-00893-3: CMOS Dual Operational Amplifier, 8-pin Narrow SOIC; Manufacturer: Texas Instruments; PowerWise: N; CompType: Amplifiers; PackageTopMarking: NSZXTT*LMC66*2CM; RoHS: N; ComponentLink1Description: Datasheet URL; PinCount: 8; Code_IPC: SOIC127P600-8; ComponentLink1URL: http://www.ti.com/general/docs/lit/getliterature.tsp?genericPartNumber=LMC662&fileType=pdf; Code_JEDEC: MS-012-AA; PackageDescription: SOIC Narrow, 4.9 x 3.9 x 1.45mm, 8 Lead, 1.27mm Pitch; Package Reference: D0008A; PartId: 1
U5 U6 = CMP-0809-00005-2: Precision, Low Noise, Rail-to-Rail Output, Zero-Drift Operational Amplifier, 4 to 36 V, -40 to 125 degC, 5-pin SOT23 (DBV5), Green (RoHS & no Sb/Br); Manufacturer: Texas Instruments; Total Supply Voltage(Min)(+5V is 5, +/-5V is 10): 4; Offset Drift(Typ)(uV/C): 0.03; Rating: Catalog; SubFamily: Zero Drift Precision Amplifier; GBW(Typ)(MHz): 2; Slew Rate(Typ)(V/us): 0.8; Number of Channels: 1; CMRR(Min)(dB): 120; Iq per channel(Max)(mA): 0.51; Total Supply Voltage(Max)(+5V is 5, +/-5V is 10): 36; PartNumber: OPA188AIDBVR; ComponentLink2Description: Datasheet; ComponentLink2URL: http://www.ti.com/lit/ds/symlink/opa188.pdf; ComponentLink1Description: Manufacturer URL; Mounting Technology: Surface Mount; Eco-Plan: Green (RoHS & no Sb/Br); ComponentLink1URL: http://www.ti.com/; PackageVersion: 4073253-4/K, 03/2006; DatasheetVersion: SBOS642A; ComponentLink3Description: Package Specification; PackageReference: DBV0005A; ComponentLink3URL: http://www.ti.com/litv/pdf/mpds018i; PackageDescription: 5-Pin Plastic Small Outline, Body 1.6 x 2.9 mm, Pitch 0.95 mm; Code_JEDEC: MO-178